# EAGLE board regsimple2addfp (EAGLE 7.6.0), part 1 of 2
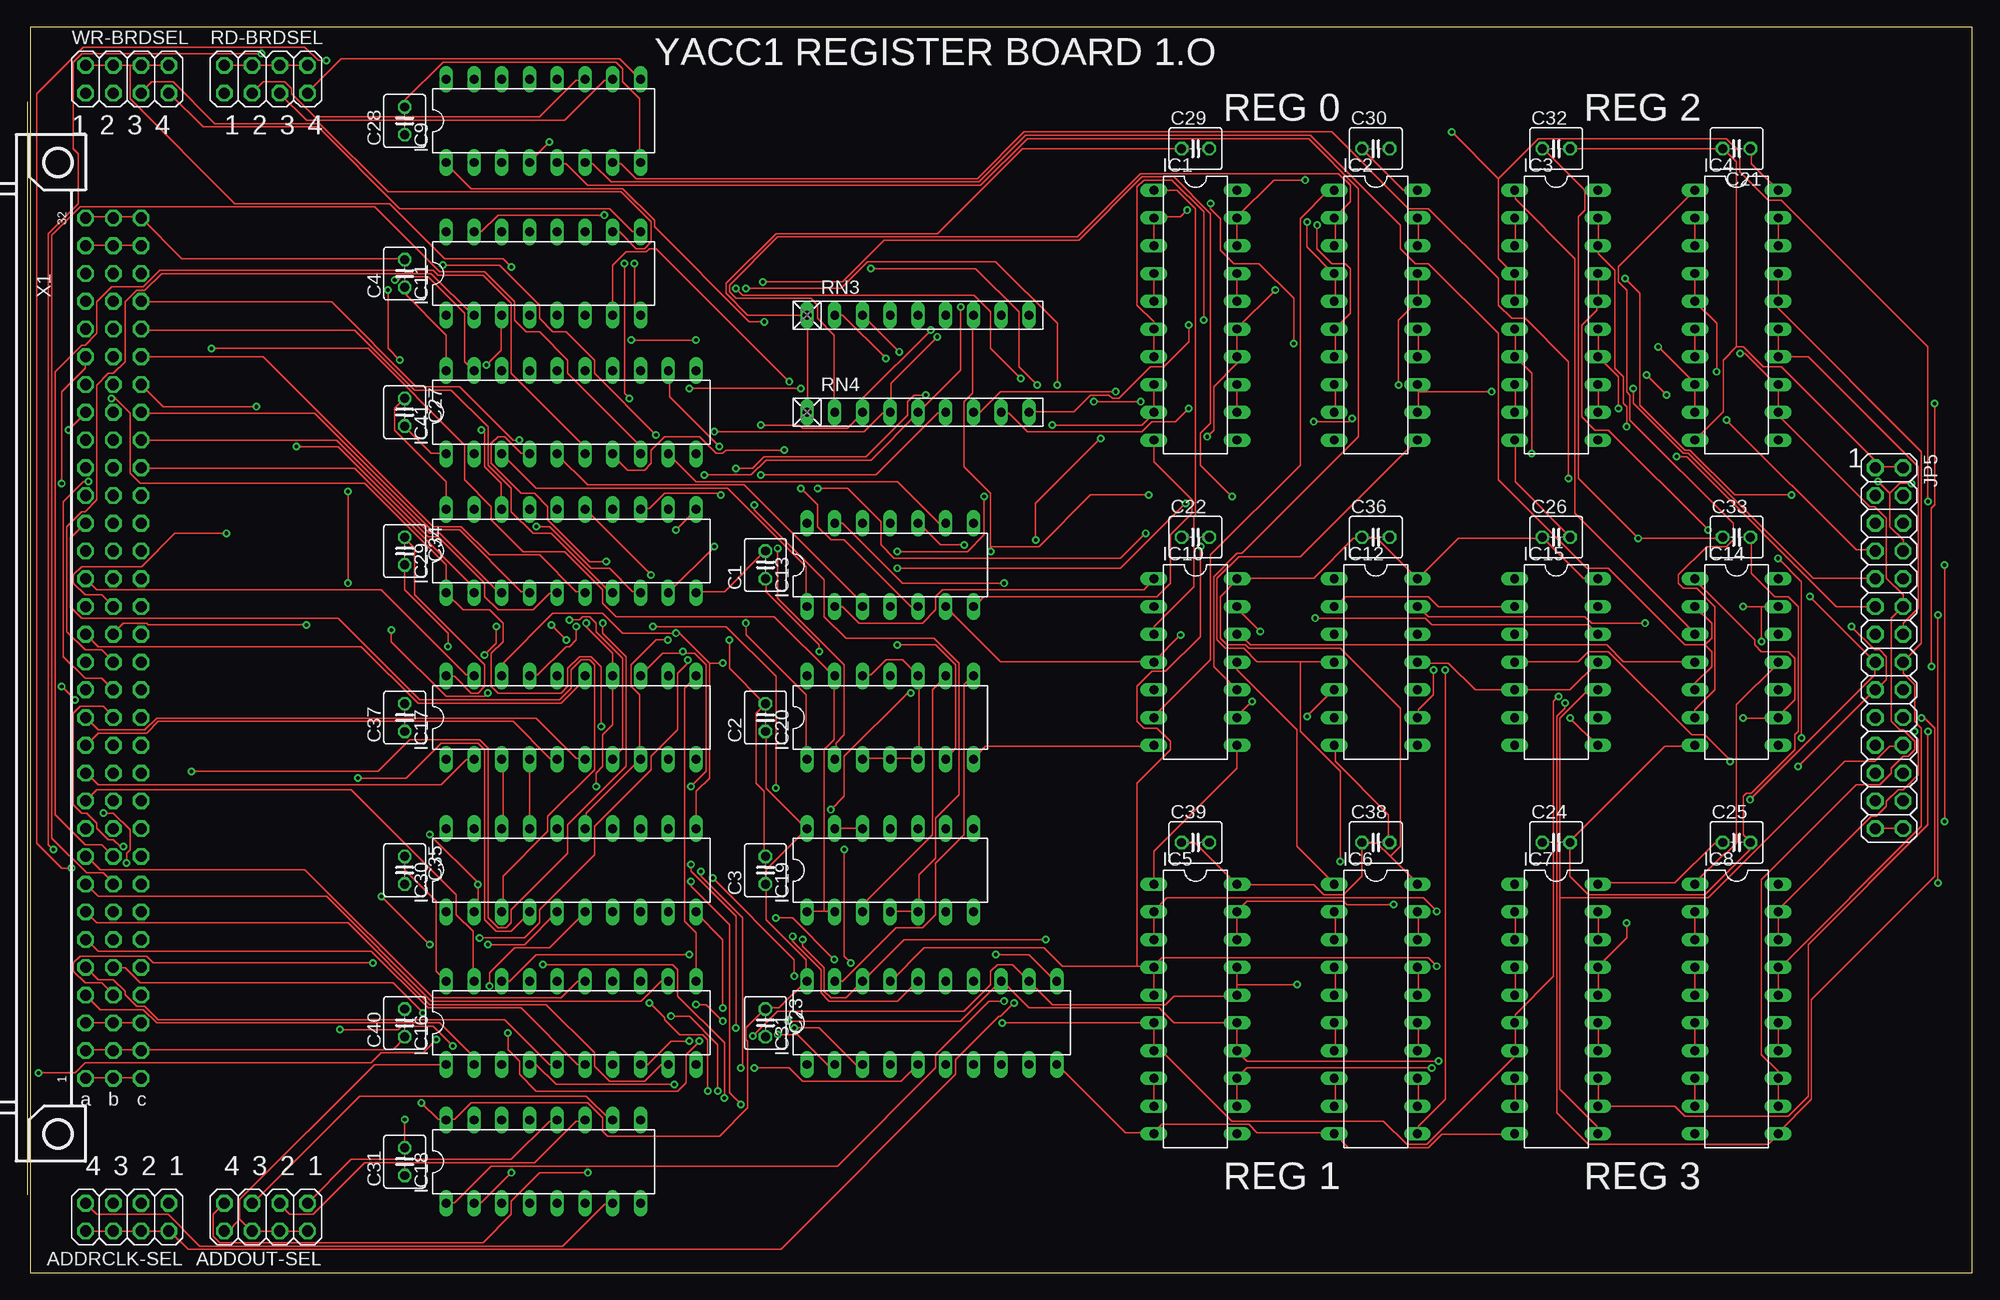
[diagram p2: board, top side]
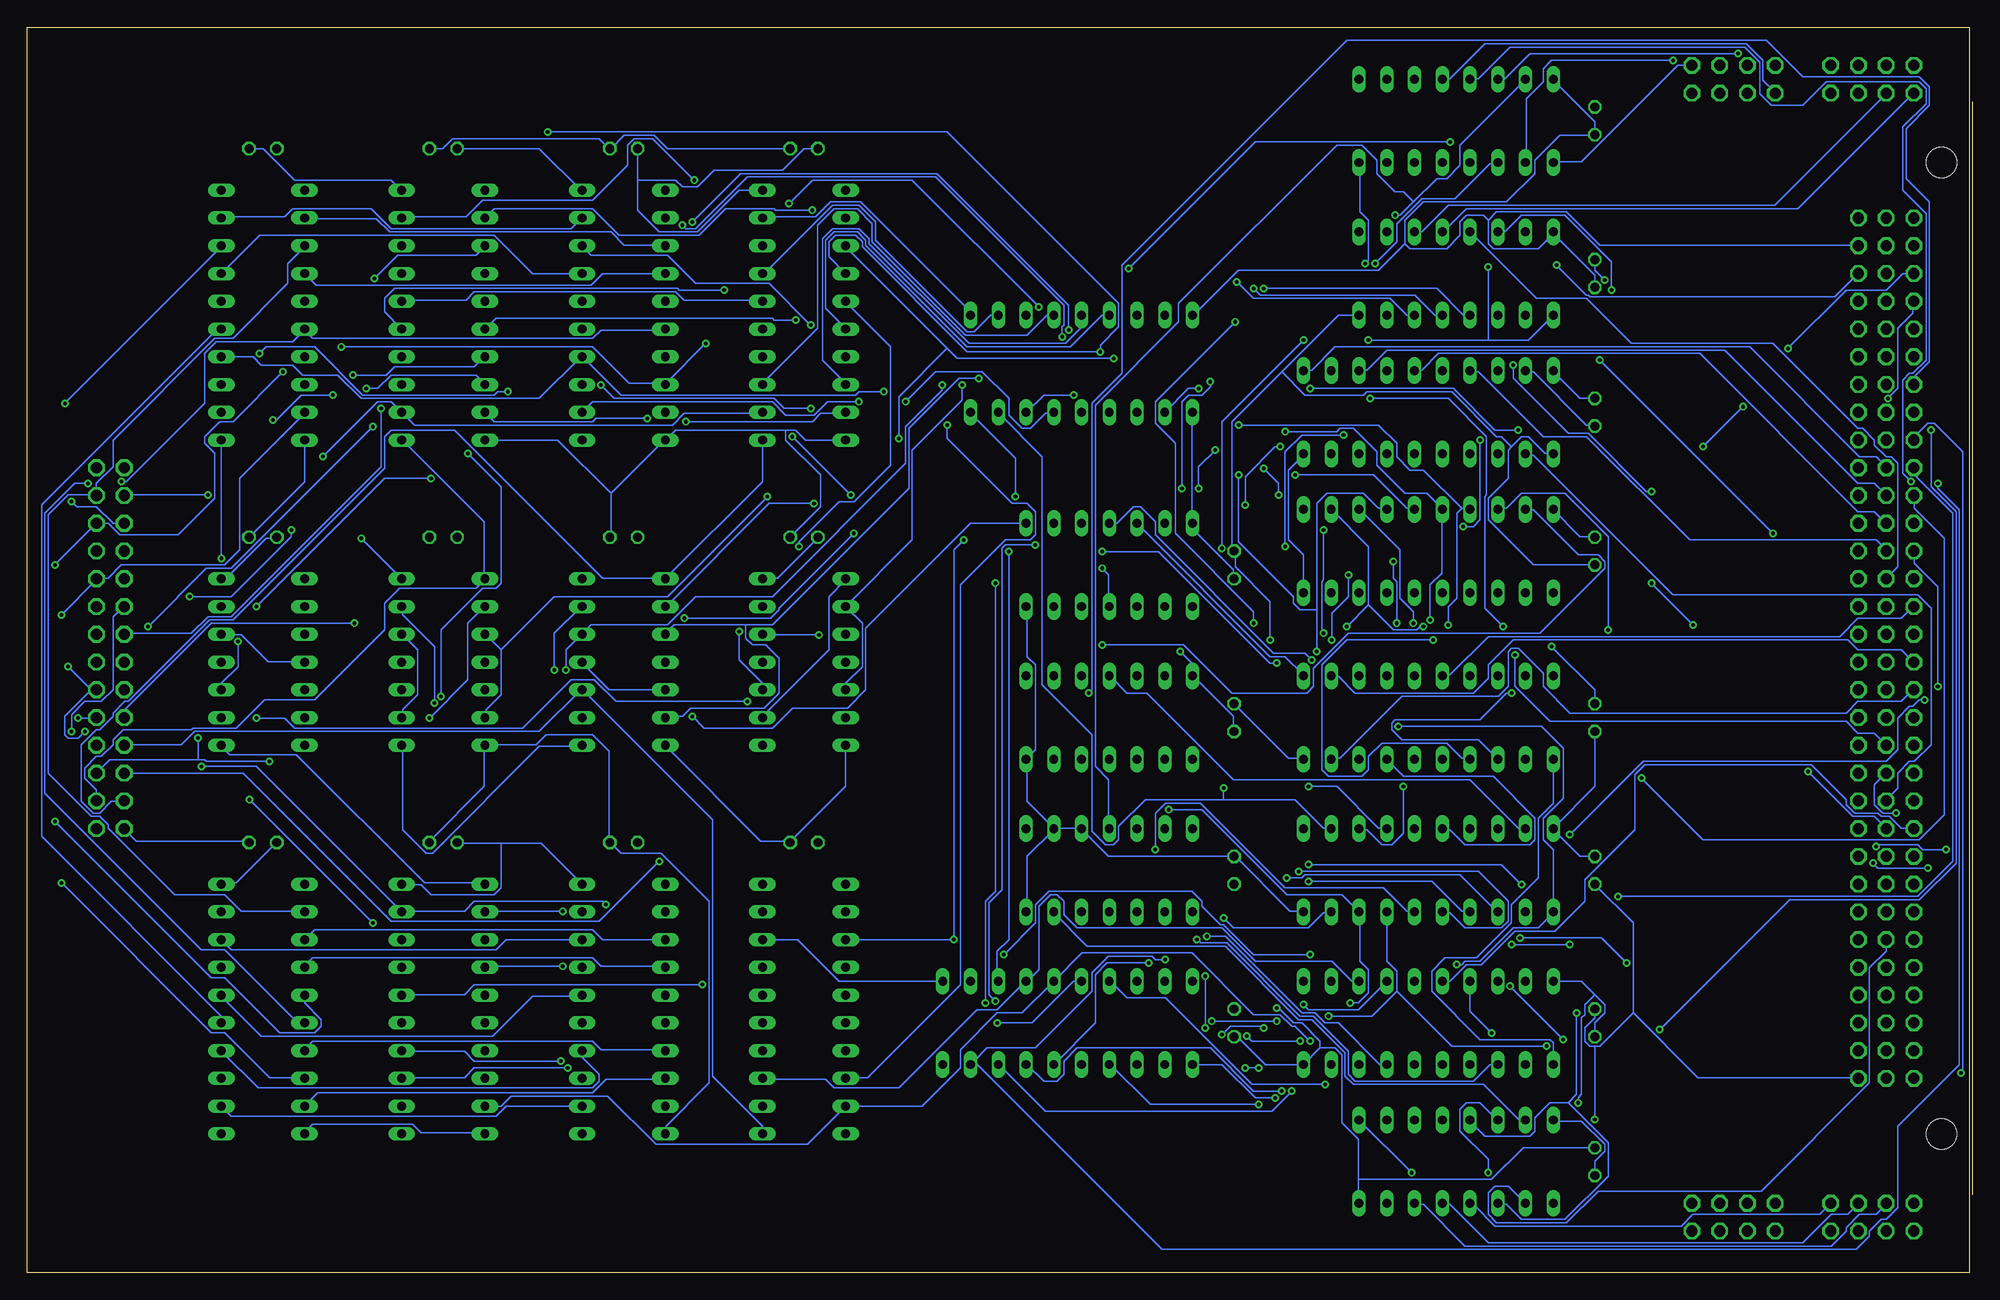
[diagram p3: board, bottom side, seen from below]

Size 177.78 x 113.97 mm. Coordinates in mm from the lower left corner, seen from the top.
Outline: 0,0 177.78,0 177.78,113.97 0,113.97 0,0
Copper layers (1*16): Top 0.0356mm / dielectric 1.5011mm / Bottom 0.0356mm
Design rules "LaenPCBOrder": minimum track width 6mil, minimum drill 13mil, track to track 6mil, track to pad 6mil, pad to pad 6mil, via to via 6mil, smd to smd 6mil, copper to edge 15mil, drill to drill 6mil, minimum pad ring 7mil, minimum via ring 7mil, stop-mask expansion 3mil, vias tented up to drill 0mil, thermal gap 10mil

## Footprints (pad centres in the part's own frame; a part is rotated, then mirrored left to right if it is on the bottom)
2X04 = drill 1.016 octagon: 1 -3.81,-1.27; 2 -3.81,1.27; 3 -1.27,-1.27; 4 -1.27,1.27; 5 1.27,-1.27; 6 1.27,1.27; 7 3.81,-1.27; 8 3.81,1.27
C025-040X050 = drill 0.813 octagon: 1 -1.27,0; 2 1.27,0
DIL20 = drill 0.813 long: 1 -11.43,-3.81; 2 -8.89,-3.81; 3 -6.35,-3.81; 4 -3.81,-3.81; 5 -1.27,-3.81; 6 1.27,-3.81; 7 3.81,-3.81; 8 6.35,-3.81; 9 8.89,-3.81; 10 11.43,-3.81; 11 11.43,3.81; 12 8.89,3.81; 13 6.35,3.81; 14 3.81,3.81; 15 1.27,3.81; 16 -1.27,3.81; 17 -3.81,3.81; 18 -6.35,3.81; 19 -8.89,3.81; 20 -11.43,3.81
DIL16 = drill 0.813 long: 1 -8.89,-3.81; 2 -6.35,-3.81; 3 -3.81,-3.81; 4 -1.27,-3.81; 5 1.27,-3.81; 6 3.81,-3.81; 7 6.35,-3.81; 8 8.89,-3.81; 9 8.89,3.81; 10 6.35,3.81; 11 3.81,3.81; 12 1.27,3.81; 13 -1.27,3.81; 14 -3.81,3.81; 15 -6.35,3.81; 16 -8.89,3.81
DIL14 = drill 0.813 long: 1 -7.62,-3.81; 2 -5.08,-3.81; 3 -2.54,-3.81; 4 0,-3.81; 5 2.54,-3.81; 6 5.08,-3.81; 7 7.62,-3.81; 8 7.62,3.81; 9 5.08,3.81; 10 2.54,3.81; 11 0,3.81; 12 -2.54,3.81; 13 -5.08,3.81; 14 -7.62,3.81
2X14 = drill 1.016 octagon: 1 -16.51,-1.27; 2 -16.51,1.27; 3 -13.97,-1.27; 4 -13.97,1.27; 5 -11.43,-1.27; 6 -11.43,1.27; 7 -8.89,-1.27; 8 -8.89,1.27; 9 -6.35,-1.27; 10 -6.35,1.27; 11 -3.81,-1.27; 12 -3.81,1.27; 13 -1.27,-1.27; 14 -1.27,1.27; 15 1.27,-1.27; 16 1.27,1.27; 17 3.81,-1.27; 18 3.81,1.27; 19 6.35,-1.27; 20 6.35,1.27; 21 8.89,-1.27; 22 8.89,1.27; 23 11.43,-1.27; 24 11.43,1.27; 25 13.97,-1.27; 26 13.97,1.27; 27 16.51,-1.27; 28 16.51,1.27
RN-9 = drill 0.813 long: 1 -10.16,0; 2 -7.62,0; 3 -5.08,0; 4 -2.54,0; 5 0,0; 6 2.54,0; 7 5.08,0; 8 7.62,0; 9 10.16,0
FABC96R = drill 1.016 octagon: A1 -2.54,39.37; A2 -2.54,36.83; A3 -2.54,34.29; A4 -2.54,31.75; A5 -2.54,29.21; A6 -2.54,26.67; A7 -2.54,24.13; A8 -2.54,21.59; A9 -2.54,19.05; A10 -2.54,16.51; A11 -2.54,13.97; A12 -2.54,11.43; A13 -2.54,8.89; A14 -2.54,6.35; A15 -2.54,3.81; A16 -2.54,1.27; A17 -2.54,-1.27; A18 -2.54,-3.81; A19 -2.54,-6.35; A20 -2.54,-8.89; A21 -2.54,-11.43; A22 -2.54,-13.97; A23 -2.54,-16.51; A24 -2.54,-19.05; A25 -2.54,-21.59; A26 -2.54,-24.13; A27 -2.54,-26.67; A28 -2.54,-29.21; A29 -2.54,-31.75; A30 -2.54,-34.29; A31 -2.54,-36.83; A32 -2.54,-39.37; B1 -5.08,39.37; B2 -5.08,36.83; B3 -5.08,34.29; B4 -5.08,31.75; B5 -5.08,29.21; B6 -5.08,26.67; B7 -5.08,24.13; B8 -5.08,21.59; B9 -5.08,19.05; B10 -5.08,16.51; B11 -5.08,13.97; B12 -5.08,11.43; B13 -5.08,8.89; B14 -5.08,6.35; B15 -5.08,3.81; B16 -5.08,1.27; B17 -5.08,-1.27; B18 -5.08,-3.81; B19 -5.08,-6.35; B20 -5.08,-8.89; B21 -5.08,-11.43; B22 -5.08,-13.97; B23 -5.08,-16.51; B24 -5.08,-19.05; B25 -5.08,-21.59; B26 -5.08,-24.13; B27 -5.08,-26.67; B28 -5.08,-29.21; B29 -5.08,-31.75; B30 -5.08,-34.29; B31 -5.08,-36.83; B32 -5.08,-39.37; C1 -7.62,39.37; C2 -7.62,36.83; C3 -7.62,34.29; C4 -7.62,31.75; C5 -7.62,29.21; C6 -7.62,26.67; C7 -7.62,24.13; C8 -7.62,21.59; C9 -7.62,19.05; C10 -7.62,16.51; C11 -7.62,13.97; C12 -7.62,11.43; C13 -7.62,8.89; C14 -7.62,6.35; C15 -7.62,3.81; C16 -7.62,1.27; C17 -7.62,-1.27; C18 -7.62,-3.81; C19 -7.62,-6.35; C20 -7.62,-8.89; C21 -7.62,-11.43; C22 -7.62,-13.97; C23 -7.62,-16.51; C24 -7.62,-19.05; C25 -7.62,-21.59; C26 -7.62,-24.13; C27 -7.62,-26.67; C28 -7.62,-29.21; C29 -7.62,-31.75; C30 -7.62,-34.29; C31 -7.62,-36.83; C32 -7.62,-39.37 | hole 2.794: 0,-44.456; 0,44.456

## Placement (x,y rotation side)
ADDOUT-SEL  [2X04]  21.59,5.08 180 top
ADDRCLK-SEL  [2X04]  8.89,5.08 180 top
C1  [C025-040X050]  67.31,64.77 90 top
C2  [C025-040X050]  67.31,50.8 90 top
C3  [C025-040X050]  67.31,36.83 90 top
C4  [C025-040X050]  34.29,91.44 90 top
C21  [C025-040X050]  156.21,102.87 180 top
C22  [C025-040X050]  106.68,67.31 0 top
C23  [C025-040X050]  67.31,22.86 270 top
C24  [C025-040X050]  139.7,39.37 0 top
C25  [C025-040X050]  156.21,39.37 0 top
C26  [C025-040X050]  139.7,67.31 0 top
C27  [C025-040X050]  34.29,78.74 270 top
C28  [C025-040X050]  34.29,105.41 90 top
C29  [C025-040X050]  106.68,102.87 0 top
C30  [C025-040X050]  123.19,102.87 0 top
C31  [C025-040X050]  34.29,10.16 90 top
C32  [C025-040X050]  139.7,102.87 0 top
C33  [C025-040X050]  156.21,67.31 0 top
C34  [C025-040X050]  34.29,66.04 270 top
C35  [C025-040X050]  34.29,36.83 270 top
C36  [C025-040X050]  123.19,67.31 0 top
C37  [C025-040X050]  34.29,50.8 90 top
C38  [C025-040X050]  123.19,39.37 0 top
C39  [C025-040X050]  106.68,39.37 0 top
C40  [C025-040X050]  34.29,22.86 90 top
IC1  74S374N  [DIL20]  106.68,87.63 270 top
IC2  74S374N  [DIL20]  123.19,87.63 270 top
IC3  74S374N  [DIL20]  139.7,87.63 270 top
IC4  74S374N  [DIL20]  156.21,87.63 270 top
IC5  74S374N  [DIL20]  106.68,24.13 270 top
IC6  74S374N  [DIL20]  123.19,24.13 270 top
IC7  74S374N  [DIL20]  139.7,24.13 270 top
IC8  74S374N  [DIL20]  156.21,24.13 270 top
IC9  74LS139N  [DIL16]  46.99,105.41 0 top
IC10  7432N  [DIL14]  106.68,55.88 270 top
IC11  74LS139N  [DIL16]  46.99,91.44 0 top
IC12  74LS02N  [DIL14]  123.19,55.88 270 top
IC13  74LS04N  [DIL14]  78.74,64.77 0 top
IC14  7432N  [DIL14]  156.21,55.88 270 top
IC15  74LS02N  [DIL14]  139.7,55.88 270 top
IC16  74S374N  [DIL20]  49.53,22.86 0 top
IC17  74S374N  [DIL20]  49.53,50.8 0 top
IC18  74LS139N  [DIL16]  46.99,10.16 0 top
IC19  74LS00N  [DIL14]  78.74,36.83 0 top
IC20  74LS00N  [DIL14]  78.74,50.8 0 top
IC29  74LS245N  [DIL20]  49.53,66.04 0 top
IC30  74LS245N  [DIL20]  49.53,36.83 0 top
IC31  74LS245N  [DIL20]  82.55,22.86 0 top
IC41  74S244N  [DIL20]  49.53,78.74 0 top
JP5  [2X14]  170.18,57.15 270 top
RD-BRDSEL  [2X04]  21.59,109.22 0 top
RN3  [RN-9]  81.28,87.63 0 top
RN4  [RN-9]  81.28,78.74 0 top
WR-BRDSEL  [2X04]  8.89,109.22 0 top
X1  FABC96R  [FABC96R]  2.54,57.15 180 top

## Tracks (layer width: path | path; a pad name or v marks a point on that pad's centre or on a via)
+12V
  Top 0.152: X1.A3 X1.B3 X1.C3
-R0-RDSEL  (via drill 0.33)
  Top 0.152: v47.55,103.48 45.72,101.65 IC9.4 | v76.96,91.9 86.56,91.9 90.53,87.94 90.53,82.91 v92.2,81.23
  Bottom 0.152: v47.55,103.48 65.38,103.48 v76.96,91.9 | v92.2,81.23 92.2,79.86 96.77,75.29 96.77,67.06 IC10.2 101.35,59.44 101.35,55.47 102.87,53.95 IC10.5
-R0-WRSEL  (via drill 0.33)
  Top 0.152: v64.62,90.07 65.23,89.46 86.41,89.46 87.94,87.94 87.94,84.58 v90.68,81.84
  Bottom 0.152: IC11.4 46.33,87.63 48.77,90.07 v64.62,90.07 | v90.68,81.84 92.51,81.84 97.08,77.27 97.08,71.78 109.58,59.28 112.01,59.28 | 112.01,59.28 118.57,59.28 119.33,58.52 IC12.3 | 112.01,59.28 112.01,58.06 111.4,57.45 110.19,57.45 108.97,56.24 108.97,53.03 110.34,51.66 117.04,51.66 117.81,50.9 119.33,50.9 IC12.6
-R1-RDSEL  (via drill 0.33)
  Top 0.152: v112.62,58.67 110.49,60.81 IC10.13 | IC10.10 108.36,55.47 108.36,63.7 110.49,65.84 110.95,65.84 121.61,76.5 121.61,99.21 117.04,103.78 91.29,103.78 87.02,99.52 51.05,99.52 49.07,101.5 48.31,101.5 IC9.5
  Bottom 0.152: IC10.10 110.49,53.95 112.62,56.08 v112.62,58.67
-R1-WRSEL  (via drill 0.33)
  Top 0.152: v128.47,55.17 128.47,52.88 127.1,51.51 127.1,50.9 IC12.9 | v65.53,90.07 74.22,90.07 76.66,92.51 88.39,92.51 94.03,86.87 v94.03,81.23
  Bottom 0.152: v128.47,55.17 128.47,57 127.1,58.37 IC12.12 126.95,58.52 126.19,59.28 119.18,59.28 116.59,61.87 109.58,61.87 97.38,74.07 97.38,77.42 94.03,80.77 v94.03,81.23 | IC11.5 48.92,87.63 50.75,89.46 64.92,89.46 v65.53,90.07
-R2-RDSEL
  Top 0.152: 153.31,57.45 151.49,57.45 144.47,64.47 142.49,64.47 134.42,72.54 134.42,85.95 128.02,92.35 126.8,92.35 125.42,93.73 125.42,95.86 117.2,104.09 91.14,104.09 86.87,99.82 53.19,99.82 51.51,101.5 50.9,101.5 IC9.6 | 153.31,57.45 153.92,58.06 153.92,59.44 IC14.2 | IC14.5 152.4,53.95 153.92,55.47 153.92,56.84 153.31,57.45
-R2-WRSEL  (via drill 0.33)
  Top 0.152: v67.06,90.68 74.37,90.68 78.18,94.49 96.01,94.49 101.8,100.28 104.7,100.28 108.05,96.93 108.05,77.72 107.14,76.81 107.14,73.91 v110.03,71.02
  Bottom 0.152: 134.42,57 134.42,52.88 135.79,51.51 135.79,50.9 IC15.6 | 134.42,57 135.79,58.37 IC15.3 | IC11.6 51.51,87.63 53.03,89.15 65.53,89.15 v67.06,90.68 | v110.03,71.02 119.18,61.87 129.54,61.87 134.42,57
-R3-RDSEL  (via drill 0.33)
  Top 0.152: v140.82,72.69 140.82,83.36 136.85,87.33 135.64,87.33 134.42,88.54 134.42,90.98 128.02,97.38 126.19,97.38 119.18,104.39 90.98,104.39 86.72,100.13 55.47,100.13 54.1,101.5 53.34,101.5 IC9.7 | IC14.13 158.5,60.96 | 158.5,60.96 v156.82,60.96 | 158.5,60.96 v158.5,57.76
  Bottom 0.152: v140.82,72.69 145.09,72.69 v156.82,60.96 | IC14.10 160.02,53.95 158.5,55.47 v158.5,57.76
-R3-WRSEL  (via drill 0.33)
  Top 0.152: IC11.7 53.34,92.2 54.56,93.42 56.39,93.42 56.69,93.73 57.3,93.73 v69.49,81.53 | v72.08,71.78 74.83,71.78 77.88,68.73 77.88,66.6 79.1,65.38 99.82,65.38 v102.11,67.67 | v117.65,59.89 127.71,59.89 128.32,59.28 142.65,59.28 IC15.12
  Bottom 0.152: v69.49,81.53 69.49,81.08 70.26,80.31 71.48,80.31 72.08,79.7 v72.08,71.78 | v102.11,67.67 108.97,60.81 108.97,60.66 109.73,59.89 v117.65,59.89 | IC15.9 143.41,50.9 143.41,51.51 142.04,52.88 142.04,57 143.41,58.37 IC15.12
-RDSEL  (via drill 0.33)
  Top 0.152: RD-BRDSEL.2 RD-BRDSEL.4 RD-BRDSEL.6 RD-BRDSEL.8 | v65.53,59.44 65.53,58.37 71.02,52.88 71.02,47.09 IC20.1 | v67.21,87.02 65.84,87.02 57.15,95.71 57.15,96.32 54.25,99.21 40.39,99.21 38.1,101.5 IC9.1
  Bottom 0.152: v65.53,59.44 65.53,60.5 72.69,67.67 72.69,75.89 74.52,77.72 74.52,79.7 v67.21,87.02 | RD-BRDSEL.8 26.67,110.49 35.51,101.65 38.1,101.65 IC9.1
-RRDH  (via drill 0.33)
  Top 0.152: 102.87,55.93 88.85,55.93 IC13.6 | 102.87,55.93 v105.31,58.37 | 102.87,55.93 IC10.4 | IC14.4 152.4,55.93 145.85,55.93 144.32,57.45 111.71,57.45 110.8,58.37 110.49,58.37 IC10.12
  Bottom 0.152: IC14.4 152.4,55.93 155.75,55.93 158.19,58.37 160.02,58.37 IC14.12 | v105.31,58.37 110.49,58.37 IC10.12
-RRDL  (via drill 0.33)
  Top 0.152: IC14.1 152.4,63.4 157.89,57.91 157.89,57.45 158.5,56.84 160.93,56.84 161.54,56.24 161.54,52.43 160.02,50.9 IC14.9 160.02,50.75 v156.82,50.75 | IC13.2 74.37,60.96 75.89,59.44 81.69,59.44 82.91,60.66 82.91,61.87 83.52,62.48 101.96,62.48 102.87,63.4 IC10.1 | v111.86,52.27 110.49,50.9 IC10.9
  Bottom 0.152: IC10.9 110.49,50.9 104.39,57 104.39,61.87 102.87,63.4 IC10.1 | v156.82,50.75 154.23,50.75 153.31,49.84 132.44,49.84 128.02,54.25 125.88,54.25 123.9,52.27 v111.86,52.27
-RWRH  (via drill 0.33)
  Top 0.152: IC15.11 140.97,53.34 IC15.5 132.28,53.34 129.84,55.78 127.1,55.78 IC12.11 | v116.89,50.9 119.33,53.34 IC12.5
  Bottom 0.152: IC12.5 124.51,53.34 126.95,55.78 IC12.11 | IC13.8 91.44,68.58 101.04,58.98 101.04,53.34 102.72,51.66 107.75,51.66 109.58,49.84 115.82,49.84 v116.89,50.9
-RWRL  (via drill 0.33)
  Top 0.152: v79.4,64.47 99.82,64.47 v105.77,70.41 | IC15.2 128.93,60.96 128.02,61.87 120.4,61.87 119.48,60.96 IC12.2 | v140.97,50.75 143.41,48.31 IC15.8
  Bottom 0.152: IC12.8 127.1,48.16 130.91,48.16 140.66,38.41 141.28,38.41 143.41,40.54 143.41,48.16 IC15.8 | v79.4,64.47 78.79,63.86 78.79,60.96 IC13.4 | v105.77,70.41 109.88,70.41 119.33,60.96 IC12.2 | v140.97,50.75 137.47,54.25 137.47,59.44 135.94,60.96 IC15.2
-WRSEL  (via drill 0.33)
  Top 0.152: WR-BRDSEL.2 WR-BRDSEL.4 9.14,110.49 | WR-BRDSEL.8 WR-BRDSEL.6 9.14,110.49 | v68.43,66.29 68.43,61.72 74.52,55.63 74.52,49.23 73.76,48.46 73.76,47.09 IC20.2 | v55.02,85.34 v60.96,85.34 | 9.14,110.49 9.14,107.44 18.75,97.84 32.92,97.84 37.95,92.81 43.28,92.81 v44.04,92.05
  Bottom 0.152: v68.43,66.29 68.43,77.88 v60.96,85.34 | 44.04,85.34 40.39,85.34 IC11.1 | 44.04,85.34 v55.02,85.34 | 44.04,85.34 v44.04,92.05
ADDR0
  Top 0.152: X1.A4 6.4,24.08 10.36,24.08 11.58,22.86 37.49,22.86 40.54,19.81 40.54,19.05 IC16.2
ADDR1
  Top 0.152: IC16.5 47.55,19.05 43.43,23.16 11.73,23.16 10.52,24.38 9.75,24.38 8.69,25.45 8.69,25.76 7.62,26.82 6.25,26.82 5.18,27.89 X1.A5
ADDR2
  Top 0.152: IC16.6 50.14,19.05 44.96,24.23 36.42,24.23 31.24,29.41 6.25,29.41 5.18,30.48 X1.A6
ADDR3
  Top 0.152: IC16.9 57.76,19.05 56.24,17.53 53.03,17.53 51.66,18.9 51.66,20.12 47.24,24.54 36.58,24.54 29.11,32 6.1,32 X1.A7
ADDR4
  Top 0.152: IC16.12 57.76,26.67 55.93,24.84 36.73,24.84 27.13,34.44 6.25,34.44 5.18,35.51 X1.A8
ADDR5
  Top 0.152: IC16.15 50.14,26.67 48.62,25.15 36.88,25.15 25.15,36.88 6.4,36.88 5.18,38.1 X1.A9
ADDR6
  Bottom 0.152: IC16.16 47.55,26.67 46.02,28.19 44.65,28.19 41.6,31.24 37.95,31.24 35.2,33.98 35.2,35.97 30.63,40.54 30.63,45.57 29.72,46.48 14.48,46.48 11.28,43.28 11.28,42.82 10.52,42.06 8.38,42.06 8.08,41.76 7.32,41.76 6.25,40.69 5.18,40.69 X1.A10
ADDR7
  Top 0.152: X1.A11 6.1,44.2 29.41,44.2 39.01,34.59 39.01,32.77 40.54,31.24 40.54,26.67 IC16.19
ADDR8
  Top 0.152: IC17.2 40.54,46.94 39.93,46.94 37.64,44.65 6.25,44.65 5.18,45.72 X1.A12
ADDR9
  Top 0.152: IC17.5 48.16,47.09 47.55,47.09 44.2,50.44 11.73,50.44 10.67,49.38 6.25,49.38 5.18,48.31 X1.A13
ADDR10
  Top 0.152: IC17.6 50.75,47.09 49.99,47.09 46.33,50.75 11.58,50.75 10.52,49.68 6.25,49.68 5.18,50.75 X1.A14
ADDR11
  Bottom 0.152: IC17.9 58.37,47.09 57.61,47.09 51.97,52.73 43.13,52.73 42.22,53.65 42.22,56.84 41.91,57.15 41.3,57.15 39.01,54.86 39.01,53.65 36.58,51.21 11.28,51.21 10.21,52.27 6.25,52.27 5.18,53.34 X1.A15
ADDR12
  Bottom 0.152: IC17.12 58.37,54.56 57.76,54.56 56.24,53.03 45.41,53.03 44.04,54.41 44.04,55.63 41.76,57.91 11.12,57.91 10.21,57 6.25,57 5.18,55.93 X1.A16
ADDR13
  Top 0.152: IC17.15 50.75,54.56 50.75,54.25 48.62,52.12 35.51,52.12 30.33,57.3 6.25,57.3 5.18,58.37 X1.A17
ADDR14
  Bottom 0.152: IC17.16 48.16,54.71 47.55,54.71 44.04,58.22 11.89,58.22 10.21,59.89 6.25,59.89 5.18,60.96 X1.A18
ADDR15
  Top 0.152: X1.A19 6.1,62.48 32.16,62.48 39.93,54.71 40.54,54.71 IC17.19
BDATA0  (via drill 0.33)
  Top 0.152: IC31.2 73,19.05 70.26,21.79 v68.43,21.79 | v64.62,22.4 64.62,32.61 60.5,36.73 v60.5,37.34 | IC30.2 41,33.38 v41,35.51 41,35.66 v36.58,40.08 | v4.12,52.43 v2.9,53.65
  Bottom 0.152: v68.43,21.79 67.67,22.55 64.77,22.55 v64.62,22.4 | v60.5,37.34 42.82,37.34 v41,35.51 | v2.9,53.65 2.9,62.79 5.03,64.92 5.03,65.99 X1.A20 | v4.12,52.43 4.57,52.43 5.18,51.82 5.49,51.82 6.55,50.75 6.55,47.85 7.62,46.79 29.87,46.79 v36.58,40.08
BDATA1  (via drill 0.33)
  Top 0.152: IC30.3 43.28,33.07 43.28,36.27 47.4,40.39 47.4,41.76 51.66,46.02 51.66,55.63 51.21,56.08 50.44,56.08 49.53,55.17 49.53,53.49 48.46,52.43 35.66,52.43 28.19,59.89 4.72,59.89 3.66,60.96 3.66,67.21 5.03,68.58 X1.A21 | IC31.3 75.59,19.05 72.24,22.4 v69.95,22.4 | v69.95,27.13 69.95,28.65 v62.48,36.12
  Bottom 0.152: v69.95,27.13 v69.95,22.4 | v62.48,36.12 61.11,36.12 60.81,36.42 46.63,36.42 43.28,33.07 IC30.3
BDATA2  (via drill 0.33)
  Top 0.152: v60.5,35.81 60.5,35.36 64.01,31.85 64.01,16.46 v65.08,15.39 | v30.02,45.26 34.44,45.26 37.64,48.46 41,48.46 41.6,47.85 41.6,32.31 42.67,31.24 44.04,31.24 45.72,32.92 IC30.4
  Bottom 0.152: v60.5,35.81 49.23,35.81 46.48,33.07 45.72,33.07 IC30.4 | v65.08,15.39 74.98,15.39 78.64,19.05 IC31.4 | v30.02,45.26 24.38,39.62 4.57,39.62 2.29,41.91 2.29,67.21 5.03,69.95 5.03,71.02 X1.A22
BDATA3  (via drill 0.33)
  Top 0.152: v61.42,36.73 61.42,36.27 65.23,32.46 65.23,18.9 v65.08,18.75 | v66.29,18.75 69.49,18.75 70.71,17.53 79.7,17.53 81.23,19.05 IC31.5 | v36.58,30.02 v32.16,34.44 | v41.91,30.02 45.26,30.02 IC30.5
  Bottom 0.152: v61.42,36.73 44.96,36.73 42.22,33.98 42.22,32.16 42.82,31.55 46.18,31.55 47.55,32.92 48.16,32.92 IC30.5 | v66.29,18.75 v65.08,18.75 | v32.16,34.44 4.72,34.44 1.52,37.64 1.52,69.49 5.03,73 5.03,73.61 X1.A23 | v41.91,30.02 v36.58,30.02
BDATA4  (via drill 0.33)
  Top 0.152: v74.52,38.71 74.52,28.96 v75.13,28.35 | v0.76,18.29 4.12,18.29 5.03,19.2 31.24,19.2 32.16,20.12 35.97,20.12 v37.19,21.34 | v42.06,26.21 42.06,27.43 44.35,29.72 47.55,29.72 50.75,32.92 IC30.6
  Bottom 0.152: v74.52,38.71 74.52,42.06 73.61,42.98 70.41,42.98 62.64,35.2 53.65,35.2 51.51,33.07 50.9,33.07 IC30.6 | v75.13,28.35 78.94,28.35 80.01,27.28 80.01,22.86 IC31.6 | v0.76,18.29 0.61,18.44 0.61,75.13 3.2,77.72 3.81,77.72 5.03,76.5 5.03,76.2 X1.A24 | v42.06,26.21 v37.19,21.34
BDATA5  (via drill 0.33)
  Top 0.152: v58.67,23.47 60.35,23.47 62.94,20.88 v62.94,16.61 | v3.5,77.11 5.03,78.64 X1.A25 | v28.35,22.25 33.68,22.25 33.98,22.55 36.88,22.55 v38.71,20.73
  Bottom 0.152: IC30.7 53.34,28.5 52.43,27.58 52.43,25.76 | 52.43,25.76 54.71,23.47 v58.67,23.47 | v62.94,16.61 65.53,16.61 69.49,20.57 81.69,20.57 82.91,19.36 82.91,18.14 83.52,17.53 84.73,17.53 86.26,19.05 IC31.7 | v3.5,77.11 3.5,71.93 1.22,69.65 1.22,37.49 4.57,34.14 16.46,34.14 v28.35,22.25 | v38.71,20.73 47.4,20.73 52.43,25.76
BDATA6  (via drill 0.33)
  Top 0.152: v56.69,24.69 58.06,23.32 58.06,23.16 59.44,21.79 61.57,21.79 62.03,21.34 v62.03,16.61 | v80.62,53.03 80.31,53.03 74.52,47.24 74.52,43.59 v73.3,42.37
  Bottom 0.152: v56.69,24.69 55.93,24.69 55.02,25.6 55.02,27.74 55.78,28.5 55.78,32.92 IC30.8 57.45,34.59 62.48,34.59 70.26,42.37 v73.3,42.37 | v62.03,16.61 63.86,14.78 84.58,14.78 88.85,19.05 IC31.8 | v80.62,53.03 80.31,53.34 80.31,79.55 77.57,82.3 77.57,92.2 57,112.78 18.59,112.78 15.24,109.42 4.57,109.42 3.66,108.51 3.66,106.83 5.79,104.7 5.79,100.13 3.66,97.99 3.66,83.36 5.03,81.99 5.03,81.38 X1.A26
BDATA7  (via drill 0.33)
  Top 0.152: v68.28,32.46 69.8,32.46 v73.61,28.65 | v2.9,72.24 2.9,80.62 5.03,82.75 5.03,83.82 X1.A27
  Bottom 0.152: v68.28,32.46 67.36,31.55 60.5,31.55 59.13,32.92 58.52,32.92 IC30.9 | v73.61,28.65 74.52,28.65 74.83,28.96 78.79,28.96 80.31,27.43 80.31,25.76 85.5,20.57 89.92,20.57 91.14,19.36 | v2.9,72.24 2.9,71.78 0.91,69.8 0.91,19.05 6.55,13.41 6.55,5.94 7.62,4.88 8.08,4.88 9.14,3.81 9.14,3.35 10.36,2.13 73.91,2.13 91.14,19.36 | 91.14,19.36 IC31.9
BDATA8
  Top 0.152: IC29.2 40.54,62.33 40.54,62.79 29.72,73.61 10.21,73.61 X1.C23
BDATA9
  Top 0.152: X1.C24 28.04,76.2 36.58,67.67 37.49,67.67 42.82,62.33 43.13,62.33 IC29.3
BDATA10
  Top 0.152: IC29.4 45.72,62.33 44.96,62.33 39.32,67.97 36.73,67.97 26.06,78.64 10.21,78.64 X1.C25
BDATA11  (via drill 0.33)
  Top 0.152: v24.38,75.59 28.19,75.59 36.42,67.36 37.34,67.36 41.6,63.09 41.6,61.87 42.82,60.66 46.02,60.66 47.55,62.18 48.16,62.18 IC29.5 | v20.73,79.25 12.19,79.25 X1.C26
  Bottom 0.152: v20.73,79.25 v24.38,75.59
BDATA12
  Top 0.152: X1.C27 21.34,83.82 36.88,68.28 39.47,68.28 42.06,65.68 46.63,65.68 49.99,62.33 50.75,62.33 IC29.6
BDATA13
  Top 0.152: IC29.7 53.34,62.33 53.03,62.33 47.7,67.67 46.02,67.67 44.04,69.65 44.04,71.78 41.91,73.91 41.91,77.42 38.56,80.77 35.2,80.77 29.72,86.26 10.21,86.26 X1.C28
BDATA14  (via drill 0.33)
  Top 0.152: v46.33,68.28 47.55,68.28 51.36,64.47 53.03,64.47 55.17,62.33 55.78,62.33 IC29.8 | v44.81,76.2 44.2,76.2 39.32,81.08 35.36,81.08 27.58,88.85 10.21,88.85 X1.C29
  Bottom 0.152: v46.33,68.28 45.41,68.28 44.81,68.89 v44.81,76.2
BDATA15  (via drill 0.33)
  Top 0.152: v62.64,66.45 IC29.9 | v57.3,76.66 51.66,82.3 51.66,83.52 49.07,86.11 47.85,86.11 46.63,87.33 46.63,88.54 42.98,92.2 v37.8,92.2
  Bottom 0.152: v62.64,66.45 62.64,75.13 61.11,76.66 v57.3,76.66 | v37.8,92.2 35.05,89.46 34.9,89.46 34.75,89.31 12.34,89.31 10.21,91.44 X1.C30
BDIR  (via drill 0.33)
  Top 0.152: v52.27,49.99 52.27,55.47 51.36,56.39 50.29,56.39 49.23,55.32 49.23,53.65 48.62,53.03 42.82,53.03 42.22,53.65 42.22,56.69 43.28,57.76 43.28,59.44 42.06,60.66 39.62,60.66 38.1,62.18 IC29.1 38.1,64.77 30.63,72.24 10.06,72.24 9.14,73.15 9.14,78.64 7.77,80.01 v7.47,80.01 | v63.55,16 63.55,21.03 59.28,25.3 59.28,27.74 58.83,28.19 v46.94,28.19
  Bottom 0.152: v52.27,49.99 39.17,49.99 37.19,48.01 37.19,43.43 39.01,41.6 39.01,39.62 38.1,38.71 IC30.1 38.1,32.92 39.47,31.55 41.76,31.55 44.81,28.5 46.18,28.5 46.48,28.19 v46.94,28.19 | IC31.1 68.43,19.05 65.38,16 v63.55,16 | v7.47,80.01 6.55,80.92 6.55,86.41 5.18,87.78 5.18,88.85 X1.A29
BRAOUT
  Top 0.152: IC41.8 55.78,74.98 55.78,75.74 49.23,82.3 49.23,83.52 46.63,86.11 45.41,86.11 44.35,87.17 44.35,88.85 41.6,91.59 37.49,91.59 31.55,97.54 4.57,97.54 1.98,94.94 1.98,39.78 5.18,36.58 6.71,36.58 7.62,35.66 X1.B8
BRDN
  Top 0.152: X1.B9 6.55,39.17 5.03,39.17 2.29,41.91 2.29,82.45 4.72,84.89 5.03,84.89 6.1,85.95 6.1,88.85 7.47,90.22 10.36,90.22 11.89,91.75 36.88,91.75 37.34,91.29 41.45,91.29 44.04,88.7 44.04,82.3 50.75,75.59 50.75,74.98 IC41.6
BRESET
  Bottom 0.152: IC41.2 40.54,74.83 39.93,74.83 27.13,62.03 4.72,62.03 3.5,60.81 3.5,48.31 5.03,46.79 5.49,46.79 6.55,45.72 6.55,44.35 7.62,43.28 X1.B11
BRRDH
  Bottom 0.152: IC41.13 55.78,82.6 55.17,82.6 53.34,84.43 22.4,84.43 10.21,72.24 8.69,72.24 7.62,71.17 X1.B22
BRRDL
  Bottom 0.152: IC41.17 45.72,82.45 44.96,82.45 39.01,76.5 35.05,76.5 25.6,67.06 8.53,67.06 7.62,66.14 X1.B20
BRUP  (via drill 0.33)
  Top 0.152: v52.73,65.08 51.21,65.08 47.4,68.89 47.4,70.1 46.18,71.32 44.96,71.32 42.22,74.07 42.22,75.89 42.82,76.5 43.43,76.5 44.96,74.98 45.72,74.98 IC41.4 | v52.43,59.44 52.43,58.52 54.56,56.39 54.56,46.33 49.23,41 49.23,38.41 44.04,33.22 44.04,32 43.59,31.55 42.82,31.55 41.91,32.46 41.91,48.01 41.15,48.77 34.75,48.77 31.85,45.87 v14.78,45.87
  Bottom 0.152: v52.73,65.08 52.73,63.55 52.43,63.25 v52.43,59.44 | v14.78,45.87 10.67,41.76 8.69,41.76 7.62,40.69 X1.B10
BRWRH
  Bottom 0.152: IC41.11 60.96,82.6 60.2,82.6 58.06,84.73 20.12,84.73 10.06,74.68 8.53,74.68 7.62,73.76 X1.B23
BRWRL
  Bottom 0.152: X1.B21 8.69,69.65 10.21,69.65 24.69,84.12 48.62,84.12 50.14,82.6 50.75,82.6 IC41.15
CLK0H  (via drill 0.33)
  Top 0.152: 116.28,55.93 112.32,55.93 111.1,57.15 109.42,57.15 108.66,57.91 108.66,63.55 110.64,65.53 116.28,65.53 126.95,76.2 IC2.11 | 116.28,55.93 119.33,55.93 IC12.4 | v119.94,37.64 119.94,45.87 116.28,49.53 116.28,55.93
  Bottom 0.152: JP5.23 158.04,45.72 144.47,32.16 125.42,32.16 v119.94,37.64
CLK0L
  Bottom 0.152: IC1.11 110.49,72.39 IC12.1 119.48,63.55 125.12,63.55 138.68,77.11 144.47,77.11 145.09,76.5 145.09,73.61 158.95,59.74 161.09,59.74 168.55,52.27 168.86,52.27 169.93,51.21 169.93,50.9 171.15,49.68 171.45,49.68 172.82,48.31 172.82,43.13 171.75,42.06 171.15,42.06 170.08,43.13 169.01,43.13 JP5.25
CLK1H  (via drill 0.33)
  Top 0.152: v129.54,55.17 129.54,15.85 127.1,13.41 127.1,12.8 IC6.11 | v147.83,59.44 142.95,59.44 142.34,60.05 128.02,60.05 127.1,60.96 IC12.13
  Bottom 0.152: v129.54,55.17 129.54,58.52 127.1,60.96 IC12.13 | v147.83,59.44 160.93,59.44 168.86,51.51 168.86,50.9 JP5.19
CLK1L
  Bottom 0.152: IC5.11 110.49,13.41 115.06,17.98 115.06,41.45 126.95,53.34 IC12.10 127.1,53.34 130.91,49.53 162.46,49.53 163.68,48.31 168.86,48.31 JP5.21
CLK2H  (via drill 0.33)
  Top 0.152: v155.6,46.79 155.6,46.94 153.31,49.23 152.09,49.23 144.47,56.84 142.65,56.84 141.73,55.93 135.94,55.93 IC15.4 | v160.02,65.38 162.15,63.25 v162.15,48.92
  Bottom 0.152: v155.6,46.79 161.39,46.79 161.54,46.94 162.15,46.94 | 162.15,46.94 170.23,46.94 JP5.24 | v160.02,65.38 IC4.11 | 162.15,46.94 v162.15,48.92
CLK2L
  Bottom 0.152: IC3.11 143.41,76.2 135.94,68.73 135.94,63.55 IC15.1 135.94,63.4 136.7,62.64 143.71,62.64 145.09,61.27 145.09,58.83 151.49,52.43 156.06,52.43 158.65,49.84 162.61,49.84 162.76,49.68 169.01,49.68 169.93,48.77 169.93,48.31 170.99,47.24 171.45,47.24 172.52,46.18 172.52,45.26 171.45,44.2 JP5.26
CLK3H  (via drill 0.33)
  Top 0.152: v140.51,52.12 140.51,51.66 139.75,50.9 139.75,14.63 142.65,11.73 159.11,11.73 160.02,12.65 IC8.11 160.02,12.8 163.07,15.85 163.07,24.99 174.35,36.27 174.35,49.84 173.43,50.75 v173.13,50.75
  Bottom 0.152: v140.51,52.12 140.51,57.3 143.41,60.2 143.41,60.96 IC15.13 | v173.13,50.75 171.45,50.75 JP5.20
CLK3L
  Top 0.152: 140.06,34.29 140.06,50.75 142.65,53.34 IC15.10 | 140.06,34.29 140.06,16.76 143.41,13.41 143.41,12.8 IC7.11 | 140.06,34.29 153.62,34.29 166.12,46.79 168.86,46.79 170.23,48.16 171.45,48.16 JP5.22
DATA0  (via drill 0.33)
  Top 0.152: IC7.3 135.94,30.48 135.94,32.92 IC7.2 | IC5.3 IC5.2 102.87,33.07 104.09,34.29 127.56,34.29 v128.78,33.07 | v70.71,30.48 70.71,29.87 72.69,27.89 72.69,25.76 73.3,25.15 74.68,25.15 IC31.18 80.01,30.48 v92.96,30.48 | RN3.2 74.37,87.63 v78.33,83.67 | IC1.3 IC1.2 102.87,96.62 105.31,96.62 v105.92,97.23 | IC3.3 135.94,94.03 135.94,96.47 IC3.2 | v161.24,71.17 156.06,71.17 151.94,75.29 151.49,75.29 147.37,79.4 147.37,89.61 v146,90.98 | v92.05,67.06 92.05,70.41 v97.99,76.35
  Bottom 0.152: IC16.3 43.89,19.05 45.41,17.53 56.24,17.53 56.84,18.14 56.84,20.27 60.05,23.47 61.27,23.47 67.97,30.18 70.41,30.18 v70.71,30.48 | IC5.3 v92.96,30.48 92.96,66.14 v92.05,67.06 | v128.78,33.07 135.79,33.07 IC7.2 | v78.33,83.67 92.66,83.67 93.57,84.58 | 93.57,84.58 102.87,93.88 IC1.3 | v161.24,71.17 168.86,71.17 JP5.3 | v146,90.98 143.87,93.12 136.7,93.12 135.94,93.88 IC3.3 | v105.92,97.23 109.27,97.23 109.42,97.38 113.84,97.38 116.28,94.94 123.6,94.94 126.03,97.38 135.03,97.38 IC3.2 | v97.99,76.35 97.99,80.16 93.57,84.58
DATA1  (via drill 0.33)
  Top 0.152: IC7.5 135.94,25.45 135.94,27.89 IC7.4 | IC5.5 IC5.4 102.87,28.04 | IC16.4 46.33,19.05 48.16,17.22 v58.98,17.22 | 101.35,28.04 94.49,28.04 92.81,29.72 81.84,29.72 78.79,26.67 IC31.17 | 101.35,28.04 102.87,28.04 | v128.78,28.04 128.02,28.8 103.63,28.8 102.87,28.04 | v79.55,84.28 RN3.3 | IC1.4 IC1.5 | IC3.5 135.94,89 135.94,91.44 IC3.4 135.79,91.44 134.42,92.81 134.42,100.13 | v173.74,70.56 173.74,84.73 160.32,98.15 159.11,98.15 156.51,100.74 156.51,102.56 155.3,103.78 138.07,103.78 134.42,100.13 | 134.42,100.13 v130.15,104.39 | 101.35,28.04 101.35,44.81 104.39,47.85 104.39,48.62 103.17,49.84 101.96,49.84 101.35,50.44 101.35,53.65 102.72,55.02 103.94,55.02 107.14,58.22 v107.14,66.45
  Bottom 0.152: v58.98,17.22 65.68,17.22 73.61,25.15 77.11,25.15 78.64,26.67 IC31.17 | v128.78,28.04 135.79,28.04 IC7.4 | IC1.4 104.39,92.96 104.39,94.34 103.78,94.94 101.96,94.94 101.35,94.34 101.35,93.88 91.75,84.28 v79.55,84.28 79.55,84.89 77.88,86.56 77.88,88.7 93.57,104.39 v130.15,104.39 | JP5.5 169.93,68.58 171.45,70.1 173.28,70.1 v173.74,70.56 | v107.14,66.45 107.14,66.9 103.48,70.56 102.11,70.56 98.75,73.91 98.75,84.73 102.87,88.85 IC1.5
DATA2  (via drill 0.33)
  Top 0.152: v69.8,30.79 69.8,30.33 72.39,27.74 72.39,25.6 73.15,24.84 79.4,24.84 81.23,26.67 IC31.16 | 135.94,22.86 135.94,20.42 IC7.7 135.79,20.27 135.79,19.66 127.86,11.73 126.03,11.73 123.9,13.87 110.03,13.87 103.63,20.27 102.87,20.27 IC5.7 IC5.6 v89,22.86 | IC1.7 IC1.6 102.87,87.02 101.35,88.54 101.35,99.36 101.96,99.97 104.55,99.97 107.44,97.08 v107.44,87.17 | 135.94,83.82 135.94,86.26 IC3.6 | v155.3,78.03 167.18,66.14 168.86,66.14 JP5.7 | v147.98,82.14 v149.81,80.31 | 135.94,22.86 135.94,23.62 139.45,27.13 139.45,52.27 v139.9,52.73 | v137.47,74.98 137.47,82.3 135.94,83.82 | 135.94,22.86 IC7.6 | 135.94,83.82 IC3.7
  Bottom 0.152: IC16.7 53.95,19.05 57.76,22.86 58.98,22.86 59.89,23.77 61.11,23.77 68.12,30.79 v69.8,30.79 | IC31.16 81.99,26.67 85.8,22.86 v89,22.86 | RN3.4 79.4,87.63 82.3,84.73 91.75,84.73 101.04,94.03 101.04,94.49 101.8,95.25 103.94,95.25 104.7,94.49 104.7,88.24 102.87,86.41 IC1.6 | v155.3,78.03 154.99,78.03 152.71,80.31 v149.81,80.31 | v147.98,82.14 144.93,82.14 144.17,82.91 136.85,82.91 135.94,83.82 IC3.7 | v107.44,87.17 109.42,87.17 109.58,87.33 134.87,87.33 135.79,86.41 IC3.6 | v139.9,52.73 139.9,58.83 136.09,62.64 134.87,62.64 134.42,63.09 134.42,71.93 v137.47,74.98
DATA3  (via drill 0.33)
  Top 0.152: IC7.9 135.94,15.24 135.94,17.68 IC7.8 | IC5.8 IC5.9 | IC16.8 56.54,19.05 58.67,21.18 v60.35,21.18 | IC1.8 IC1.9 102.87,78.64 101.8,77.57 v93.57,77.57 | IC3.9 135.94,78.79 135.94,81.23 IC3.8 | v146.76,80.92 146.76,79.55 151.33,74.98 151.79,74.98 163.22,63.55 168.86,63.55 JP5.9 | v117.5,77.88 120.7,77.88 v121.01,78.18
  Bottom 0.152: v60.35,21.18 61.72,22.55 62.03,22.55 63.09,23.62 65.53,23.62 71.17,29.26 81.23,29.26 IC31.15 86.72,23.77 89,23.77 92.35,20.42 92.35,18.75 95.86,15.24 IC5.9 106.38,11.73 120.24,11.73 124.66,16.15 133.5,16.15 134.42,15.24 IC7.9 | RN3.5 81.38,87.63 81.38,86.41 82.75,85.04 91.59,85.04 100.74,94.18 100.74,94.64 101.65,95.56 104.09,95.56 105,94.64 105,83.52 102.87,81.38 IC1.8 | v146.76,80.92 145.69,80.92 144.47,82.14 136.7,82.14 135.94,81.38 IC3.8 | v117.5,77.88 105.92,77.88 105.16,78.64 102.87,78.64 IC1.9 | v121.01,78.18 125.73,78.18 126.03,77.88 135.03,77.88 IC3.9 | v93.57,77.57 93.57,76.35 87.63,70.41 86.26,70.41 85.5,69.65 85.5,67.51 85.95,67.06 88.24,67.06 92.35,62.94 92.35,26.36 100.89,17.83 102.87,17.83 IC5.8
DATA4  (via drill 0.33)
  Top 0.152: 143.56,15.24 143.56,17.68 IC7.13 | IC5.12 IC5.13 110.49,17.83 111.4,18.75 v128.32,18.75 | IC1.13 IC1.12 | IC3.12 143.56,78.79 143.56,81.23 IC3.13 | JP5.11 165.35,60.96 151.64,74.68 v150.72,74.68 | 143.56,15.24 150.57,15.24 151.49,14.33 160.93,14.33 162.76,16.15 162.76,30.02 173.74,41 v173.74,49.53 | 143.56,15.24 IC7.12
  Bottom 0.152: IC16.13 56.54,26.67 58.37,28.5 65.38,28.5 68.43,31.55 81.69,31.55 82.91,32.77 82.91,33.98 83.52,34.59 84.12,34.59 85.19,33.53 85.19,27.74 86.26,26.67 IC31.14 86.41,26.67 89,24.08 90.83,24.08 97.99,16.92 103.94,16.92 104.7,17.68 110.49,17.68 IC5.13 | v128.32,18.75 136.85,18.75 137.77,17.83 143.41,17.83 IC7.13 | RN3.6 84.43,87.63 86.26,85.8 91.9,85.8 100.43,94.34 100.43,96.01 101.8,97.38 103.94,97.38 105.46,95.86 105.46,86.41 110.49,81.38 IC1.13 | v150.72,74.68 145.69,79.7 144.47,79.7 IC3.12 142.34,77.57 118.72,77.57 117.65,78.64 110.49,78.64 IC1.12 | v173.74,49.53 173.74,51.05 172.52,52.27 170.99,52.27 169.93,53.34 169.93,60.05 169.01,60.96 JP5.11
DATA5  (via drill 0.33)
  Top 0.152: 143.56,83.82 143.56,86.26 IC3.15 | v145.39,79.1 145.39,81.99 143.56,83.82 | 143.56,83.82 IC3.14 | v114,89.92 110.49,86.41 IC1.15 IC1.14 110.49,83.21 108.36,81.08 108.36,77.11 v107.75,76.5 | IC7.14 143.56,20.42 143.56,22.86 IC7.15 | v60.96,24.54 61.87,24.54 v63.4,23.01 | v69.34,23.01 85.19,23.01 88.85,26.67 IC31.13 89,26.67 91.44,24.23 103.33,24.23 104.7,22.86 IC5.15 IC5.14 110.49,20.27 111.4,19.36 v128.93,19.36 | v87.94,65.99 87.94,66.45 | 87.94,66.45 87.94,71.32 85.5,73.76 85.5,79.7 86.26,80.47 86.26,87.63 RN3.7 | v102.41,71.17 97.08,71.17 92.35,66.45 87.94,66.45
  Bottom 0.152: v145.39,79.1 145.39,73.76 159.11,60.05 161.24,60.05 162.76,58.52 168.86,58.52 JP5.13 | v114,89.92 118.11,89.92 118.26,90.07 144.17,90.07 145.09,89.15 145.09,87.94 IC3.15 | IC16.14 55.93,24.08 60.5,24.08 v60.96,24.54 | v69.34,23.01 v63.4,23.01 | v87.94,65.99 87.94,30.48 89,29.41 89,26.67 IC31.13 | v128.93,19.36 136.85,19.36 137.77,20.27 143.41,20.27 IC7.14 | v102.41,71.17 v107.75,76.5
DATA6  (via drill 0.33)
  Top 0.152: IC3.17 143.56,91.44 143.56,89 IC3.16 143.41,88.85 143.41,88.09 142.04,86.72 142.04,78.33 143.26,77.11 144.47,77.11 v153.62,67.97 | IC1.17 IC1.16 | IC7.16 143.56,25.45 143.56,27.89 IC7.17 143.56,28.04 146.15,30.63 v146.15,32 | v157.43,43.28 168.86,54.71 168.86,55.78 JP5.15 v162.92,61.87 | IC5.17 110.49,26.36 | 110.49,26.36 IC5.16 110.49,25.3 104.7,25.3 103.94,24.54 93.57,24.54 IC31.12 89.92,28.19 88.54,28.19 87.94,27.58 87.94,26.36 85.5,23.93 68.43,23.93 v66.14,21.64 | v43.74,21.95 43.74,20.42 44.81,19.36 44.81,18.14 46.33,16.61 59.28,16.61 60.05,17.37 60.05,19.96 v61.27,21.18 | 110.49,26.36 v115.98,26.36
  Bottom 0.152: RN3.8 89.61,87.63 91.14,86.11 91.75,86.11 100.13,94.49 100.13,96.16 101.65,97.69 104.09,97.69 110.34,91.44 IC1.17 | IC3.16 143.41,89 137.62,89 136.85,89.76 118.42,89.76 117.65,89 110.49,89 IC1.16 | v146.15,32 v157.43,43.28 | IC16.17 45.72,23.93 v43.74,21.95 | v61.27,21.18 65.68,21.18 v66.14,21.64 | v115.98,26.36 136.85,26.36 137.77,25.45 143.41,25.45 IC7.16 | v153.62,67.97 153.62,67.36 159.11,61.87 v162.92,61.87
DATA7  (via drill 0.33)
  Top 0.152: IC3.19 143.56,96.47 143.56,94.03 IC3.18 143.56,93.88 143.56,93.27 145.09,91.75 145.09,82.75 145.85,81.99 145.85,79.55 146.15,79.25 v146.15,77.42 | IC1.18 IC1.19 110.49,96.62 113.84,99.97 v116.74,99.97 | IC7.18 143.56,30.48 143.56,32.92 IC7.19 | v161.85,46.33 168.86,53.34 JP5.17 169.01,53.34 169.93,54.25 169.93,56.39 169.32,57 168.86,57 v166.73,59.13 | IC5.18 IC5.19 110.49,33.07 111.4,33.98 120.24,33.98 120.55,33.68 v124.82,33.68 | IC16.18 43.89,26.67 46.33,29.11 v60.35,29.11 | v88.39,29.11 91.44,29.11 93.88,26.67 IC31.11
  Bottom 0.152: RN3.9 91.44,87.94 101.5,97.99 104.24,97.99 105.61,96.62 110.49,96.62 IC1.19 | v116.74,99.97 120.55,103.78 122.22,103.78 122.83,103.17 122.83,101.35 126.03,98.15 136.09,98.15 137.62,96.62 143.41,96.62 IC3.19 | v161.85,46.33 156.82,46.33 IC7.19 143.41,33.07 137.77,33.07 136.85,33.98 125.12,33.98 v124.82,33.68 | v60.35,29.11 65.53,29.11 68.28,31.85 68.58,31.85 70.26,33.53 70.26,33.98 71.17,34.9 84.28,34.9 85.5,33.68 85.5,32 v88.39,29.11 | IC5.18 107.29,30.48 103.48,26.67 IC31.11 | v146.15,77.42 159.11,64.47 161.39,64.47 v166.73,59.13
DATA8  (via drill 0.33)
  Top 0.152: IC6.3 119.48,30.48 119.48,32.92 IC6.2 | IC8.2 IC8.3 | IC4.2 IC4.3 | IC30.18 43.28,40.69 43.28,46.94 IC17.3 | v33.07,58.83 33.07,57.76 38.1,52.73 41.6,52.73 v41.91,53.03 | RN4.2 73.61,78.79 73.61,85.8 72.08,87.33 72.08,88.54 71.48,89.15 64.62,89.15 64.01,89.76 64.01,90.37 68.43,94.79 95.86,94.79 101.65,100.58 119.79,100.58 120.85,99.52 120.85,97.99 IC2.2 119.48,96.47 119.48,94.03 IC2.3 | v41.3,77.11 41.6,76.81 41.6,73.76 43.13,72.24 43.13,69.95 IC29.18 | v70.56,80.92 v60.35,80.92
  Bottom 0.152: IC6.3 125.12,30.48 126.03,31.39 151.49,31.39 IC8.3 | 171.45,71.17 171.45,72.24 169.93,73.76 169.93,76.2 160.63,85.5 158.95,85.5 153.92,90.53 153.92,92.35 152.4,93.88 IC4.3 | 171.45,71.17 174.04,71.17 175.87,69.34 175.87,45.72 171.91,41.76 171.15,41.76 170.38,41 170.38,40.69 164.29,34.59 159.72,34.59 158.19,33.07 152.4,33.07 IC8.2 | 171.45,71.17 JP5.4 | v33.07,58.83 33.07,67.36 37.03,71.32 41,71.32 42.37,69.95 43.13,69.95 IC29.18 | v41.91,53.03 42.37,53.03 44.81,50.6 52.58,50.6 52.88,50.29 52.88,49.68 51.97,48.77 44.96,48.77 IC17.3 | v41.3,77.11 43.43,77.11 47.24,80.92 v60.35,80.92 | v70.56,80.92 71.48,80.92 RN4.2 | IC4.2 152.4,96.47 145.85,96.47 144.63,95.25 124.36,95.25 123.14,94.03 119.48,94.03 IC2.3
DATA9  (via drill 0.33)
  Top 0.152: IC17.4 IC30.17 | v66.9,77.57 70.41,77.57 70.71,77.27 74.83,77.27 76.2,78.64 RN4.3 76.2,80.01 v82.45,86.26 | v47.7,59.28 v49.07,57.91 | IC6.5 119.48,25.45 119.48,27.89 IC6.4 | IC8.4 IC8.5 | IC2.5 119.48,89 119.48,91.44 IC2.4 119.33,91.44 116.89,93.88 v116.89,96.16 | IC4.4 IC4.5 152.4,88.85 154.38,86.87 v154.38,82.45 | v175.26,64.77 v175.26,41.3
  Bottom 0.152: 46.48,69.95 45.72,69.95 IC29.17 | 46.48,69.95 49.99,73.46 51.21,73.46 52.43,74.68 52.43,75.89 54.1,77.57 v66.9,77.57 | v49.07,57.91 57,57.91 59.28,55.63 59.28,46.02 58.67,45.41 55.63,45.41 55.02,46.02 55.02,47.24 53.8,48.46 47.85,48.46 46.48,47.09 45.72,47.09 IC17.4 | v47.7,59.28 47.7,60.96 46.94,61.72 46.94,69.49 46.48,69.95 | IC6.4 119.48,28.04 125.27,28.04 126.03,28.8 151.64,28.8 152.4,28.04 IC8.4 | v154.38,82.45 158.95,77.88 160.17,77.88 161.54,76.5 161.54,75.89 160.63,74.98 160.63,70.87 163.98,67.51 169.32,67.51 170.38,68.58 JP5.6 v175.26,64.77 | IC2.4 125.12,91.44 126.19,90.37 151.33,90.37 IC4.4 | IC8.5 152.4,24.69 150.88,23.16 150.88,22.55 151.49,21.95 154.69,21.95 159.72,26.98 160.93,26.98 v175.26,41.3 | v82.45,86.26 82.45,88.54 94.49,100.58 112.47,100.58 v116.89,96.16
DATA10  (via drill 0.33)
  Top 0.152: v49.38,59.74 50.29,59.74 50.6,60.05 51.21,60.05 51.82,59.44 51.82,58.67 54.25,56.24 54.25,48.01 53.34,47.09 IC17.7 | v62.64,76.96 76.35,76.96 78.03,78.64 78.64,78.64 RN4.4 78.79,78.79 78.79,81.38 v83.06,85.65 | IC6.7 119.48,20.42 119.48,22.86 IC6.6 | IC8.6 IC8.7 | IC2.7 119.48,83.82 119.48,86.26 IC2.6 119.48,86.41 120.85,87.78 120.85,91.9 120.4,92.35 119.18,92.35 117.81,93.73 v117.81,95.86 | IC4.6 IC4.7 | JP5.8 171.45,67.06 170.23,68.28 170.23,71.32 | v169.16,72.39 170.23,71.32 | v172.21,72.24 171.15,72.24 170.23,71.32
  Bottom 0.152: IC30.16 48.16,40.54 47.55,40.54 46.18,39.17 40.23,39.17 39.78,39.62 39.78,41.6 43.59,45.41 51.82,45.41 53.34,46.94 IC17.7 | v49.38,59.74 49.38,62.94 48.31,64.01 48.31,69.8 IC29.16 48.31,69.95 49.68,71.32 51.66,71.32 54.25,73.91 54.25,75.13 56.39,77.27 57.61,77.27 57.91,76.96 v62.64,76.96 | IC6.7 119.48,20.42 125.27,20.42 126.03,21.18 151.64,21.18 152.4,20.42 IC8.7 | v169.16,72.39 168.71,72.39 161.54,79.55 161.54,84.12 160.48,85.19 153.47,85.19 152.4,86.26 | 152.4,86.26 151.64,85.5 126.03,85.5 125.27,86.26 119.48,86.26 IC2.6 | 152.4,86.26 IC4.6 | IC8.6 153.01,22.86 159.72,29.57 161.85,29.57 176.17,43.89 176.17,69.49 173.43,72.24 v172.21,72.24 | v83.06,85.65 83.06,86.56 82.91,86.72 82.91,88.54 94.64,100.28 111.86,100.28 116.59,95.56 117.5,95.56 v117.81,95.86
DATA11  (via drill 0.33)
  Top 0.152: IC30.15 50.9,40.69 50.9,42.06 55.78,46.94 IC17.8 55.78,47.09 55.78,52.88 55.02,53.65 55.02,55.63 57.3,57.91 v58.37,57.91 | v61.72,73 65.99,73 67.36,74.37 76.96,74.37 81.23,78.64 RN4.5 81.38,78.79 85.19,82.6 v85.19,88.39 | v56.84,63.86 50.9,69.8 IC29.15 | IC6.9 119.48,15.24 119.48,17.68 IC6.8 | IC8.8 IC8.9 | IC2.9 119.48,78.79 119.48,81.23 IC2.8 | IC4.9 IC4.8 152.4,81.38 v149.05,84.73 | v174.65,60.2 v174.65,35.66 | v108.05,97.84 108.05,97.38 108.97,96.47 108.97,93.57 110.19,92.35 112.47,92.35 115.67,89.15 v115.67,85.04
  Bottom 0.152: v61.72,73 54.56,73 51.51,69.95 50.9,69.95 IC29.15 | v58.37,57.91 58.37,60.35 56.84,61.87 v56.84,63.86 | IC8.9 151.18,16.46 126.03,16.46 124.82,17.68 119.48,17.68 IC6.8 | IC4.9 152.4,78.64 158.34,72.69 158.34,66.14 159.72,64.77 169.16,64.77 170.38,63.55 171.45,63.55 JP5.10 171.45,63.4 v174.65,60.2 | v149.05,84.73 126.03,84.73 122.68,81.38 119.48,81.38 IC2.8 119.33,81.38 v115.67,85.04 | v174.65,35.66 160.93,21.95 159.72,21.95 155.6,17.83 152.4,17.83 IC8.8 | v85.19,88.39 96.77,99.97 105.92,99.97 v108.05,97.84
DATA12  (via drill 0.33)
  Top 0.152: v60.5,44.5 61.87,45.87 61.87,55.63 60.81,56.69 59.74,56.69 | 59.74,56.69 57.91,56.69 55.93,54.71 IC17.13 | 59.74,56.69 v59.74,56.84 | v66.9,73 77.42,73 83.06,78.64 83.82,78.64 RN4.6 | IC6.12 127.1,15.24 127.1,17.68 IC6.13 | IC8.12 IC8.13 160.02,18.44 158.5,19.96 158.5,35.97 167.18,44.65 169.32,44.65 170.38,45.72 170.38,46.18 171.45,47.24 171.91,47.24 172.52,47.85 172.52,48.62 171.45,49.68 171.15,49.68 170.38,50.44 170.38,59.89 JP5.12 171.45,62.03 169.93,63.55 169.93,69.04 168.86,70.1 168.4,70.1 160.02,78.49 IC4.12 160.02,81.08 | 127.1,80.62 127.1,81.23 IC2.13 | 127.1,80.62 127.1,78.79 IC2.12 | 160.02,81.08 IC4.13 160.02,81.23 | v133.81,80.62 127.1,80.62 | v156.51,84.12 156.97,84.12 160.02,81.08 | v101.65,79.7 v97.38,79.7
  Bottom 0.152: v60.5,44.5 57.91,44.5 54.1,40.69 53.34,40.69 IC30.14 | v59.74,56.84 59.74,60.66 | 59.74,60.66 59.74,70.41 58.83,71.32 55.47,71.32 54.1,69.95 53.34,69.95 IC29.14 | v66.9,73 66.9,66.9 61.87,61.87 61.87,61.27 61.27,60.66 59.74,60.66 | IC6.12 133.96,15.24 134.87,14.33 159.11,14.33 IC8.12 | v133.81,80.62 134.72,80.62 135.03,80.31 147.07,80.31 151.49,84.73 155.91,84.73 v156.51,84.12 | v97.38,79.7 94.64,82.45 90.37,82.45 87.94,80.01 87.94,78.49 86.72,77.27 85.95,77.27 84.58,78.64 83.82,78.64 RN4.6 | v101.65,79.7 104.55,79.7 105.77,78.49 108.36,78.49 109.58,79.7 126.03,79.7 IC2.12
DATA13  (via drill 0.33)
  Top 0.152: IC6.14 127.1,20.42 127.1,22.86 IC6.15 | IC8.15 IC8.14 | IC4.15 IC4.14 162.76,83.82 172.82,73.76 172.82,60.81 171.45,59.44 JP5.14 | v50.9,59.44 50.9,59.13 53.34,56.69 IC17.14 53.34,50.14 52.43,49.23 52.43,46.33 51.82,45.72 v51.82,44.5 | v99.36,80.62 88.85,80.62 87.02,78.79 86.41,78.79 RN4.7 | IC2.15 127.1,86.26 127.1,83.82 IC2.14 | v63.25,71.17 63.09,71.32 58.06,71.32 56.69,69.95 55.93,69.95 IC29.13 | v64.62,73.61 66.14,73.61 67.21,74.68 76.5,74.68 80.31,78.49 80.31,79.7 80.92,80.31 v81.99,80.31
  Bottom 0.152: IC6.14 126.95,20.27 126.95,19.66 125.42,18.14 125.42,17.53 126.03,16.92 156.67,16.92 160.02,20.27 IC8.14 | IC8.15 160.02,23.47 176.48,39.93 176.48,70.26 160.48,86.26 160.02,86.26 IC4.15 | v50.9,59.44 50.9,60.5 52.12,61.72 52.12,66.14 55.78,69.8 IC29.13 | v51.82,44.5 51.82,40.23 52.88,39.17 53.8,39.17 55.17,40.54 55.78,40.54 IC30.13 | v99.36,80.62 101.65,80.62 101.96,80.31 123.44,80.31 126.95,83.82 IC2.14 127.1,83.82 130.91,80.01 147.22,80.01 149.35,82.14 152.55,82.14 153.47,83.06 156.36,83.06 157.12,83.82 IC4.14 | v63.25,71.17 63.25,72.24 v64.62,73.61 | v81.99,80.31 84.73,80.31 86.26,78.79 RN4.7
DATA14  (via drill 0.33)
  Top 0.152: v49.99,59.13 49.99,57.91 49.38,57.3 49.07,57.3 46.48,54.71 45.72,54.71 IC17.17 | v57,59.13 63.7,59.13 68.28,54.56 v68.28,44.35 | IC2.17 127.1,91.44 127.1,89 IC2.16 125.27,87.17 v125.27,81.23 | IC4.17 IC4.16 160.02,88.24 173.13,75.13 173.13,57.61 171.45,55.93 JP5.16 171.45,54.86 172.52,53.8 172.52,50.44 173.13,49.84 173.13,40.84 160.02,27.74 | IC6.16 127.1,25.45 127.1,27.89 IC6.17 | 160.02,27.74 IC8.17 160.02,27.89 | 160.02,27.74 IC8.16 | v106.07,79.1 104.85,77.88 102.72,77.88 101.8,76.96 91.29,76.96 89.61,78.64 89,78.64 RN4.8
  Bottom 0.152: v49.99,59.13 50.29,59.13 50.6,58.83 52.73,58.83 55.02,61.11 | 55.02,61.11 55.02,66.45 IC29.12 | 68.28,43.28 75.44,43.28 77.88,40.84 77.88,39.62 78.33,39.17 79.1,39.17 80.31,40.39 80.31,49.23 84.89,53.8 84.89,74.68 88.85,78.64 RN4.8 | 68.28,43.28 61.72,43.28 59.13,40.69 58.52,40.69 IC30.12 | v57,59.13 55.02,61.11 | 68.28,43.28 v68.28,44.35 | IC2.17 131.52,91.44 135.03,94.94 156.51,94.94 IC4.17 | IC6.16 127.1,25.3 131.52,25.3 135.18,21.64 156.36,21.64 160.02,25.3 IC8.16 | v106.07,79.1 108.51,79.1 109.42,80.01 124.05,80.01 v125.27,81.23
DATA15  (via drill 0.33)
  Top 0.152: IC6.18 127.1,30.48 127.1,32.92 IC6.19 | IC8.18 IC8.19 160.02,33.22 168.55,41.76 169.01,41.76 169.93,42.67 169.93,43.13 170.99,44.2 171.45,44.2 172.82,45.57 172.82,48.77 172.52,49.07 v172.52,49.53 | IC30.11 60.96,44.04 62.18,45.26 62.18,55.78 | 62.18,55.78 59.44,58.52 v59.13,58.52 54.25,58.52 52.43,60.35 47.85,60.35 43.28,55.78 43.28,54.71 IC17.18 | v59.13,67.97 60.96,69.8 IC29.11 | IC4.19 IC4.18 | v106.07,86.72 106.07,85.19 103.78,82.91 102.56,82.91 99.67,80.01 99.06,80.01 98.75,80.31 97.08,80.31 95.56,78.79 91.44,78.79 RN4.9 | IC2.19 127.1,96.47 127.1,94.03 IC2.18 | v63.4,55.78 62.18,55.78 | v79.4,65.99 85.8,65.99 87.33,67.51 v87.33,71.02 | v174.04,55.47 174.04,69.95 174.35,70.26 v174.35,79.55
  Bottom 0.152: 171.91,53.34 174.35,50.9 174.35,49.23 174.04,48.92 173.13,48.92 v172.52,49.53 | IC6.18 133.96,30.48 134.87,29.57 159.11,29.57 IC8.18 | v59.13,67.97 59.13,63.4 59.28,63.25 59.28,58.67 v59.13,58.52 | v106.07,86.72 109.88,90.53 116.59,90.53 119.18,93.12 126.19,93.12 126.95,93.88 IC2.18 | IC4.19 160.02,96.62 154.23,96.62 153.47,97.38 146.3,97.38 144.47,95.56 128.02,95.56 127.1,96.47 IC2.19 | v63.4,55.78 64.01,55.78 74.22,65.99 v79.4,65.99 | v87.33,71.02 87.33,74.52 91.44,78.64 RN4.9 | v174.04,55.47 171.91,53.34 | v174.35,79.55 160.02,93.88 IC4.18 | 171.91,53.34 JP5.18
GND  (via drill 0.33)
  Top 0.152: C28.2 34.29,107.29 37.8,110.8 53.65,110.8 54.25,110.19 54.25,108.97 55.78,107.44 55.78,101.65 IC9.8 | IC29.10 60.96,62.33 63.55,62.33 67.21,65.99 C1.2 | v55.32,92.35 55.32,88.09 55.78,87.63 IC11.8 | 7.62,96.62 5.18,96.62 X1.A32 | C4.2 34.29,92.81 13.87,92.81 X1.C32 10.06,96.62 7.62,96.62 | 7.62,96.62 X1.B32 | IC41.1 38.1,74.98 36.73,74.98 34.29,77.42 C27.2 | v38.25,57.3 38.25,58.52 34.29,62.48 C34.2 | v33.38,90.83 33.68,90.83 33.98,91.14 36.42,91.14 39.78,87.78 39.78,83.36 40.54,82.6 IC41.19 | JP5.2 171.45,73.76 169.01,73.76 JP5.1 168.86,73.76 168.86,74.37 160.32,82.91 158.65,82.91 156.82,84.73 156.21,84.73 | 156.21,84.73 154.99,83.52 154.99,78.79 IC4.10 | C32.2 C21.2 154.99,102.87 156.21,101.65 156.21,84.73 | 7.62,17.83 5.18,17.83 X1.A1 | 7.62,17.83 10.06,17.83 X1.C1 | 7.62,17.83 X1.B1 | C31.2 v34.29,14.02 | 102.87,12.8 100.28,12.8 94.03,19.05 IC31.10 | 102.87,12.8 103.63,13.56 111.56,13.56 112.32,12.8 119.33,12.8 IC6.10 119.48,12.65 120.7,11.43 128.02,11.43 129.24,12.65 135.79,12.65 IC7.10 | 102.87,12.8 IC5.10 | JP5.28 171.45,40.69 169.01,40.69 JP5.27 | IC14.7 152.4,48.16 149.66,48.16 140.97,39.47 C24.2 140.97,36.27 142.65,34.59 153.31,34.59 157.43,38.71 157.43,39.32 C25.2 157.43,39.47 156.82,40.08 156.82,43.59 157.12,43.89 157.58,43.89 161.54,47.85 161.54,49.23 161.85,49.53 161.85,60.96 160.93,61.87 159.72,61.87 157.58,64.01 157.58,67.21 C33.2 | IC3.10 135.94,76.2 135.94,72.39 140.97,67.36 C26.2 | IC12.7 119.48,48.16 119.48,46.79 124.36,41.91 124.36,39.47 C38.2 | C3.2 67.21,38.1 67.21,44.04 66.45,44.81 66.45,51.21 C2.2 67.21,52.12 64.01,55.32 v64.01,57.91
  Top 0.152: IC10.7 102.87,48.16 87.48,48.16 86.41,47.09 IC20.7 | IC1.10 102.87,74.22 106.38,70.71 106.38,69.49 104.39,67.51 104.39,63.09 103.17,61.87 87.33,61.87 86.41,60.96 IC13.7 | v63.4,24.23 63.4,30.48 60.96,32.92 IC30.10
  Bottom 0.152: IC29.10 60.96,65.68 62.33,67.06 62.33,73.46 60.96,74.83 IC41.10 | IC11.8 57.76,87.63 62.94,82.45 | 62.94,82.45 67.51,77.88 67.51,66.29 67.36,66.14 C1.2 67.21,65.99 67.21,64.62 64.01,61.42 v64.01,57.91 | v55.32,92.35 55.02,92.66 55.02,96.32 55.78,97.08 55.78,101.5 IC9.8 | IC41.19 40.54,82.45 39.93,82.45 35.05,77.57 34.29,77.57 C27.2 | C37.2 34.29,53.34 v38.25,57.3 | 41.91,75.59 42.22,75.29 42.22,72.69 44.04,70.87 44.04,68.89 39.93,64.77 C34.2 | 41.91,75.59 41,76.5 40.39,76.5 38.86,74.98 38.1,74.98 IC41.1 | C4.2 34.29,91.75 v33.38,90.83 | 62.94,82.45 60.81,80.31 55.47,80.31 55.17,80.62 47.4,80.62 43.28,76.5 42.82,76.5 41.91,75.59 | IC4.10 152.4,72.39 C33.2 | C29.2 119.18,102.87 120.4,104.09 123.14,104.09 124.36,102.87 C30.2 124.51,102.87 125.42,103.78 138.84,103.78 139.75,102.87 C32.2 | C40.2 34.29,23.32 35.2,22.4 35.2,21.18 34.75,20.73 34.29,20.73 | 34.29,20.73 33.83,20.73 30.79,23.77 | 30.79,23.77 30.79,32 34.29,35.51 C35.2 | 30.79,23.77 24.84,17.83 10.21,17.83 X1.C1 | 55.93,8.53 55.93,12.19 57.45,13.72 57.45,19.96 58.06,20.57 59.44,20.57 | 55.93,8.53 55.93,6.4 IC18.8 | 59.44,20.57 IC16.10 64.47,19.05 66.9,21.49 67.21,21.49 C23.2 | C31.2 40.84,11.43 43.74,8.53 55.93,8.53 | v34.29,14.02 34.29,20.73 | IC7.10 135.94,12.8 141.73,12.8 142.49,13.56 151.64,13.56 152.4,12.8 IC8.10 | C25.2 157.58,39.47 167.79,39.47 168.86,40.54 JP5.27 | C24.2 140.97,39.47 135.94,44.5 135.94,48.16 IC15.7 135.79,48.31 131.22,48.31 130.3,49.23 126.03,49.23 124.51,47.7 124.51,39.47 C38.2 124.36,39.32 123.44,38.41 119.79,38.41 115.37,33.98 115.37,17.37 119.33,13.41 119.33,12.8 IC6.10
  Bottom 0.152: IC1.10 106.53,76.2 107.44,77.11 108.36,77.11 | 108.36,77.11 118.42,77.11 119.33,76.2 IC2.10 119.48,76.2 124.36,71.32 | C22.2 105.16,70.1 105.16,73 108.36,76.2 108.36,77.11 | 124.36,71.32 124.36,67.36 C36.2 | IC3.10 129.24,76.2 124.36,71.32 | IC10.7 102.87,44.5 107.9,39.47 C39.2 108.05,39.47 110.64,39.47 119.33,48.16 IC12.7 | IC30.10 60.96,33.07 62.18,33.07 67.21,38.1 C3.2 78.79,38.1 81.23,40.54 IC19.10 81.38,40.69 83.82,40.69 | C2.2 62.33,47.09 60.96,47.09 IC17.10 | IC19.7 86.26,33.07 86.26,38.1 83.82,40.54 IC19.9 83.82,40.69 | 83.82,40.69 86.26,43.13 86.26,46.94 IC20.7 85.5,47.85 85.5,55.63 86.26,56.39 86.26,60.96 IC13.7 | 59.44,20.57 59.44,21.18 61.11,22.86 61.87,22.86 63.25,24.23 v63.4,24.23
HLSWAP  (via drill 0.33)
  Top 0.152: 72.69,33.07 73.61,33.07 IC19.2 | 72.69,33.07 71.17,33.07 IC19.1 | 73.61,54.56 73.61,48.77 72.69,47.85 72.69,33.07 | v16.61,84.58 30.94,84.58 39.78,75.74 39.78,72.54 42.22,70.1 42.22,68.89 45.11,65.99 48.92,65.99 52.43,62.48 52.43,61.27 53.65,60.05 68.12,60.05 73.61,54.56 | 73.61,54.56 IC20.13
  Bottom 0.152: X1.A30 6.1,91.44 7.62,89.92 11.28,89.92 v16.61,84.58
N$1
  Top 0.152: IC10.3 102.87,59.13 106.53,62.79 106.53,69.19 106.68,69.34 106.68,97.38 105,99.06 IC1.1
N$2
  Bottom 0.152: IC9.12 48.16,109.27 47.55,109.27 44.35,112.47 20.42,112.47 18.9,110.95 18.9,109.12 17.83,108.05 RD-BRDSEL.1
N$3
  Top 0.152: RD-BRDSEL.3 21.34,108.97 23.32,108.97 23.93,108.36 23.93,107.9 26.06,105.77 46.63,105.77 49.99,109.12 50.75,109.12 IC9.11
N$4
  Top 0.152: IC9.10 53.34,109.12 52.58,109.12 48.92,105.46 25.3,105.46 22.86,107.9 RD-BRDSEL.5
N$5
  Top 0.152: IC9.9 55.78,109.27 53.95,111.1 28.5,111.1 25.45,108.05 RD-BRDSEL.7
N$6
  Bottom 0.152: IC11.12 48.16,95.25 46.02,97.38 15.7,97.38 5.18,107.9 WR-BRDSEL.1
N$7
  Bottom 0.152: IC11.11 50.14,95.25 47.7,97.69 17.83,97.69 7.62,107.9 WR-BRDSEL.3
N$8
  Top 0.152: IC11.10 53.95,95.25 55.47,93.73 56.24,93.73 56.84,94.34 56.84,96.16 54.1,98.91 32.77,98.91 26.52,105.16 16.92,105.16 13.11,108.97 11.12,108.97 10.21,108.05 WR-BRDSEL.5
N$9
  Top 0.152: IC11.9 55.17,95.25 53.03,97.38 33.83,97.38 26.36,104.85 15.85,104.85 12.8,107.9 WR-BRDSEL.7
N$11
  Top 0.152: ADDOUT-SEL.1 29.41,10.36 44.04,10.36 47.55,13.87 48.16,13.87 IC18.12
N$12
  Top 0.152: IC5.1 102.87,38.56 110.49,46.18 IC10.8
N$13  (via drill 0.33)
  Top 0.152: IC11.15 41.3,95.25 42.82,96.77 v52.58,96.77
  Bottom 0.152: v52.58,96.77 52.12,96.77 50.9,97.99 | 50.9,97.99 48.77,100.13 47.85,100.13 46.63,101.35 46.63,103.17 40.69,109.12 IC9.15 | 50.9,97.99 51.82,98.91 52.58,98.91 54.25,100.58 54.25,101.8 55.63,103.17 57.91,103.17 72.39,88.7 72.39,87.02 80.01,79.4 80.01,46.33 78.79,45.11 78.79,40.69 IC19.11
N$14  (via drill 0.33)
  Top 0.152: ADDRCLK-SEL.8 ADDRCLK-SEL.6 ADDRCLK-SEL.4 ADDRCLK-SEL.2 12.8,3.81 14.48,2.13 68.73,2.13 84.73,18.14 84.73,19.51 88.7,23.47 88.85,23.47 v90.07,24.69 | IC13.13 74.37,68.58 79.86,63.09 v89.15,63.09
  Bottom 0.152: v89.15,63.09 89.15,34.9 90.07,33.98 v90.07,24.69
N$15
  Top 0.152: IC3.1 135.94,99.06 135.94,98.3 141.43,92.81 141.43,69.49 152.4,58.52 IC14.3
N$17
  Bottom 0.152: IC7.1 135.94,35.66 141.43,35.66 153.16,47.4 159.26,47.4 160.02,48.16 IC14.8
N$19
  Top 0.152: IC10.11 110.49,55.17 115.98,49.68 115.98,39.01 119.33,35.66 IC6.1
N$21
  Top 0.152: IC8.1 152.4,35.66 155.14,38.41 155.3,38.41 156.21,39.32 156.21,51.97 160.02,55.78 IC14.11
N$23
  Top 0.152: IC14.6 152.4,51.51 154.23,53.34 154.23,60.96 152.55,62.64 151.33,62.64 150.88,63.09 150.88,63.86 153.47,66.45 155.3,66.45 155.91,67.06 155.91,68.58 146.46,78.03 146.46,80.31 146.15,80.62 146.15,89.92 145.39,90.68 145.39,92.05 IC4.1
N$25